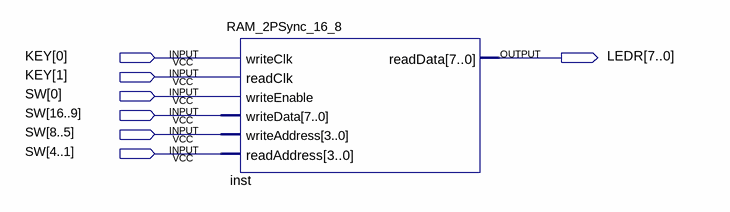
[diagram p0: schematic sheet]
// Quartus schematic RAM_2PSync_Demo.bdf as structural Verilog: 1 symbols, 7 pins
module RAM_2PSync_Demo (
  input  [1:0] KEY,
  input  [16:0] SW,
  output [7:0] LEDR
);

  RAM_2PSync_16_8 inst (
    .writeClk(KEY[0]), .readClk(KEY[1]), .writeEnable(SW[0]), .writeData(SW[16:9]), .writeAddress(SW[8:5]),
    .readAddress(SW[4:1]), .readData(LEDR));
endmodule
